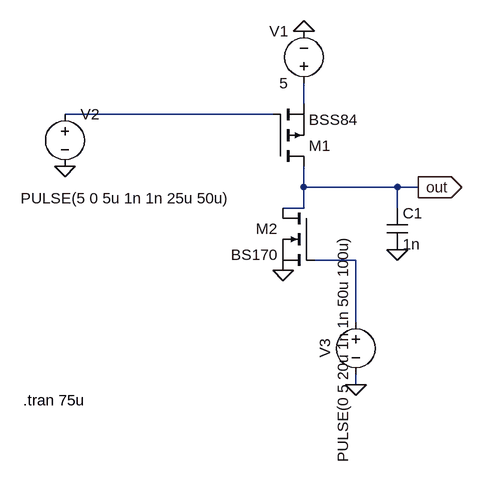
[diagram p0: schematic pixel_v1.asc]
pixel_v1.asc, the LTspice schematic file:
Version 4.1
SHEET 1 880 680
WIRE 208 80 208 48
WIRE 160 96 -160 96
WIRE 208 208 208 176
WIRE 352 208 208 208
WIRE 384 208 352 208
WIRE 208 240 208 208
WIRE 208 240 176 240
WIRE 352 240 352 208
WIRE 288 320 224 320
WIRE 288 416 288 320
WIRE 288 512 288 496
FLAG 352 304 0
FLAG 176 336 0
FLAG 208 -32 0
FLAG 384 208 out
IOPIN 384 208 Out
FLAG 288 512 0
FLAG -160 176 0
SYMBOL pmos 160 176 M180
SYMATTR InstName M1
SYMATTR Value BSS84
SYMBOL nmos 224 240 M0
SYMATTR InstName M2
SYMATTR Value BS170
SYMBOL cap 336 240 R0
SYMATTR InstName C1
SYMATTR Value 1n
SYMBOL voltage 208 64 R180
WINDOW 0 24 96 Left 2
WINDOW 3 24 16 Left 2
WINDOW 123 0 0 Left 0
WINDOW 39 0 0 Left 0
SYMATTR InstName V1
SYMATTR Value 5
SYMBOL voltage -160 80 R0
WINDOW 3 -68 145 Left 2
WINDOW 123 0 0 Left 0
WINDOW 39 0 0 Left 0
SYMATTR Value PULSE(5 0 5u 1n 1n 25u 50u)
SYMATTR InstName V2
SYMBOL voltage 288 400 R0
WINDOW 0 -32 56 VBottom 2
WINDOW 3 -4 56 VBottom 2
WINDOW 123 0 0 Left 0
WINDOW 39 0 0 Left 0
SYMATTR InstName V3
SYMATTR Value PULSE(0 5 20u 1n 1n 50u 100u)
TEXT -224 536 Left 2 !.tran 75u

The netlist it stands for:
* pixel_v1.asc
M1 out N002 N001 N001 BSS84
M2 out N003 0 0 BS170
C1 out 0 1n
V1 N001 0 5
V2 N002 0 PULSE(5 0 5u 1n 1n 25u 50u)
V3 N003 0 PULSE(0 5 20u 1n 1n 50u 100u)
.model NMOS NMOS
.model PMOS PMOS
.lib standard.mos
.tran 75u
.backanno
.end